# Altium schematic sheet MAZ000175 - Diagrama físico.SchDoc: MAZ000175 - Diagrama físico
size A; ApprovedBy: Christian Ledwidth; CheckedBy: Nahuel Martinez; Author: Santiago Marti; CompanyName: Body Health; DrawnBy: Santiago Marti; Revision: A; SheetNumber: 2; SheetTotal: 2
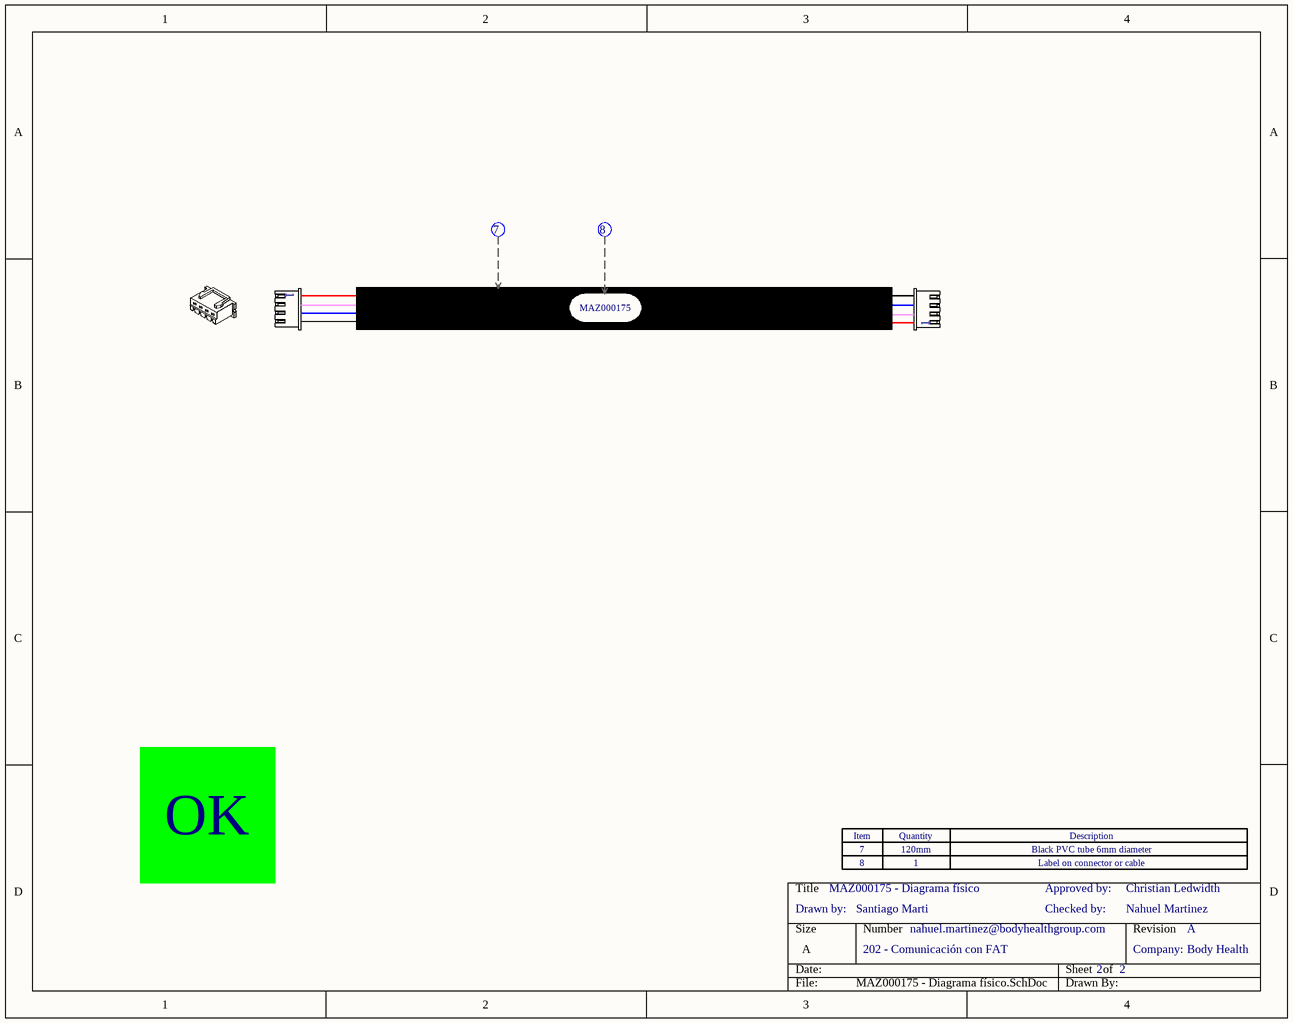
[diagram p0: MAZ000175 - Diagrama físico.SchDoc]

## Parts
Cab2  Cable  (value not drawn)
Cab3  Cable  (value not drawn)
Con1  XHP-4  (value not drawn)  (parts A,B of 4)
Con2  XHP-4  (value not drawn)  (part A of 4)
Zoc1  Zócalo_Header  (value not drawn)
Zoc8  Zócalo_Item  (value not drawn)
Zoc9  Zócalo_Item  (value not drawn)

## Notes on the sheet
- MAZ000175
- OK
- Drawn by:
- 8
- 7
- 1
- 120mm
- Checked by:
- Approved by:
- Label on connector or cable
- Black PVC tube 6mm diameter
- 202 - Comunicación con FAT
- nahuel.martinez@bodyhealthgroup.com
- Company:
- (in symbol Zócalo_Header) Item; Quantity; Description

## Library data of the parts
Cab2 = Cable: CallOut: 7; Largo: *mm; Sección: *mm2; Color: *
Cab3 = Cable: CallOut: 8; Largo: *mm; Sección: *mm2; Color: *
Con1 Con2 = XHP-4: CONN HOUSING 2.5MM 4POS; Fabricante: JST Sales America Inc.; Cod.DigiKey: 455-2267-ND; Cod.Fabricante: XHP-4; ComponentLink1Description: Manufacturer Link; ComponentLink1URL: http://www.jst-mfg.com/product/pdf/eng/eXH.pdf; DIGIKEYx50: 0.06220; CallOut: *; DIGIKEYx100: NO
Zoc1 = Zócalo_Header: Header para el zócalo de referencias
Zoc8 Zoc9 = Zócalo_Item: Ítem para el zócalo de referencias; Desginator: *; Quantity: *; ItemDescription: *